# Altium schematic sheet External_Connectors.SchDoc
size A; SheetNumber: 7; SheetTotal: 8
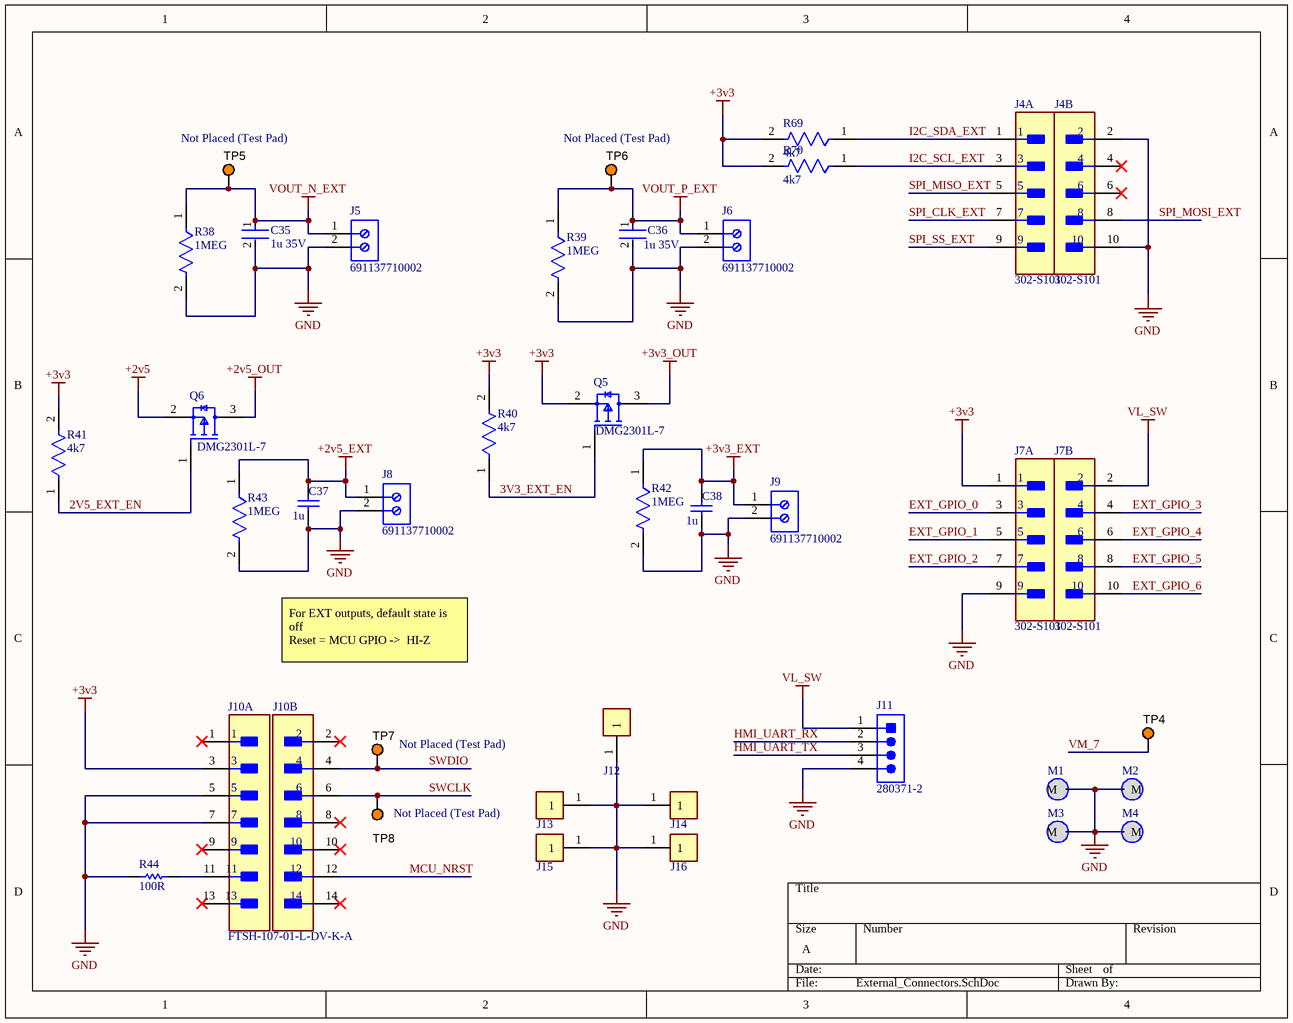
[diagram p0: External_Connectors.SchDoc]

## Parts
C35  1u 35V  [FP-CL10-IPC_C]
C36  1u 35V  [FP-CL10-IPC_C]
C37  1u  [CAPC2013X145X50NL20T25]
C38  1u  [CAPC2013X145X50NL20T25]
J4  302-S101  [FP-302-S101-MFG]  (parts A,B of 2)
J5  691137710002  [691137710002]
J6  691137710002  [691137710002]
J7  302-S101  [FP-302-S101-MFG]  (parts A,B of 2)
J8  691137710002  [691137710002]
J9  691137710002  [691137710002]
J10  FTSH-107-01-L-DV-K-A  [FP-FTSH-107-01-L-DV-K-A-MFG]  (parts A,B of 2)
J11  280371-2  [TECO-280371-2_V]
J12  5001  [FP-5001-MFG]  (value not drawn)
J13  5001  [FP-5001-MFG]  (value not drawn)
J14  5001  [FP-5001-MFG]  (value not drawn)
J15  5001  [FP-5001-MFG]  (value not drawn)
J16  5001  [FP-5001-MFG]  (value not drawn)
M1  Mounting_Holes  [Mountiing_Hole]  (value not drawn)
M2  Mounting_Holes  [Mountiing_Hole]  (value not drawn)
M3  Mounting_Holes  [Mountiing_Hole]  (value not drawn)
M4  Mounting_Holes  [Mountiing_Hole]  (value not drawn)
Q5  DMG2301L-7  [FP-SOT23-MFG]
Q6  DMG2301L-7  [FP-SOT23-MFG]
R38  1MEG  [FP-AC0603-IPC_A]
R39  1MEG  [FP-AC0603-IPC_A]
R40  4k7  [FP-AC0603-IPC_A]
R41  4k7  [FP-AC0603-IPC_A]
R42  1MEG  [FP-AC0603-IPC_A]
R43  1MEG  [FP-AC0603-IPC_A]
R44  100R  [RESC1608X55X30NL15T15]
R69  4k7  [FP-AC0603-IPC_A]
R70  4k7  [FP-AC0603-IPC_A]
TP4  5003  [KSTN-5003]  (value not drawn)
TP5  5003  [KSTN-5003]  (value not drawn)  (no BOM)
TP6  5003  [KSTN-5003]  (value not drawn)  (no BOM)
TP7  5003  [KSTN-5003]  (value not drawn)  (no BOM)
TP8  5003  [KSTN-5003]  (value not drawn)  (no BOM)

## Nets
+2v5: Q6.2(S)
+2v5_EXT: C37.2 J8.1 R43.1
+2v5_OUT: Q6.3(D)
+3v3: J7.1 J10.3 Q5.2(S) R40.2 R41.2 R69.2 R70.2
+3v3_EXT: C38.2 J9.1 R42.1
+3v3_OUT: Q5.3(D)
GND: C35.2 C36.2 C37.1 C38.1 J4.2 J4.10 J5.2 J6.2 J7.9 J8.2 J9.2 J10.5 J10.7 J11.4 J12.1 J13.1 J14.1 J15.1 J16.1 M1.M M2.M M3.M M4.M R38.2 R39.2 R42.2 R43.2 R44.2
VL_SW: J7.2 J11.1
VOUT_N_EXT: C35.1 J5.1 R38.1 TP5.1
VOUT_P_EXT: C36.1 J6.1 R39.1 TP6.1
2V5_EXT_EN: Q6.1(G) R41.1
3V3_EXT_EN: Q5.1(G) R40.1
EXT_GPIO_0: J7.3
EXT_GPIO_1: J7.5
EXT_GPIO_2: J7.7
EXT_GPIO_3: J7.4
EXT_GPIO_4: J7.6
EXT_GPIO_5: J7.8
EXT_GPIO_6: J7.10
HMI_UART_RX: J11.2
HMI_UART_TX: J11.3
I2C_SCL_EXT: J4.3 R70.1
I2C_SDA_EXT: J4.1 R69.1
MCU_NRST: J10.12
SPI_CLK_EXT: J4.7
SPI_MISO_EXT: J4.5
SPI_MOSI_EXT: J4.8
SPI_SS_EXT: J4.9
SWCLK: J10.6 TP8.1
SWDIO: J10.4 TP7.1
VM_7: TP4.1
NetJ10_11: J10.11 R44.1

Not connected (* = marked no-connect by the designer): J4 4* 6*; J10 1* 2* 8* 9* 10* 13* 14*

## Notes on the sheet
- (near TP5) Not Placed (Test Pad)
- (near TP6) Not Placed (Test Pad)
- For EXT outputs, default state is off
  Reset = MCU GPIO ->  HI-Z
- (near TP7) Not Placed (Test Pad)
- (near TP8) Not Placed (Test Pad)

## Library data of the parts
C35 C36 = CMP-13271-002885-1: Cap Ceramic 1uF 35V X5R ±10% Pad SMD 0603 +85°C T/R; Dielectric: X5R; Tolerance: 10%; Packaging: Tape and Reel; Contact Plating: Tin; Case/Package: 0603; Length: 0.063inch; Case Code (Metric): 1608; Voltage Rating (DC): 35V; Capacitance: 1uF; Package Quantity: 1; Thickness: 0.035inch; Voltage Rating: 35V; Width: 0.031inch; Min Operating Temperature: -55°C; Case Code (Imperial): 0603; Termination: Wraparound; Lead Free: Lead Free; Max Operating Temperature: 85°C; Mount: Surface Mount
C37 C38 = CMP-2007-01213-1: Part Number: C0805C106M9RACTU; Manufacturer: Kemet
J4 J7 = CMP-15228-000002-1: CONN HEADER VERT 10POS 2.54MM; Voltage Rating: 250V; Row Spacing: 0.1inch; Number of Positions: 10; Mount: Through Hole; Series: 302; Contact Type: Male Pin; Contact Plating: Gold; Contact Material: Brass; Number of Rows: 2; Color: Black; Contact Finish - Mating: GOLD; Packaging: Bulk; Pitch: 0.1inch; Fastening Type: Pull; Insulation Color: Black; Termination: Solder; Flammability Rating: UL94 V-0; Connector Type: Header; Max Operating Temperature: 105°C; Insulation Material: Glass; Contact Shape: Square; Min Operating Temperature: -40°C
J5 J6 J8 J9 = CMP-1502-03324-2: NexarPartId: 78871135; Voltage Rating: 300V; Number of Contacts: 2; Current Rating: 16A; Lead Pitch: 5mm; Height: 11.6mm; Packaging: Box; RoHS: Non-Compliant; Contact Material: Nickel, Tin; Max Operating Temperature: 120°C; Number of Pins: 2; Min Operating Temperature: -30°C; Number of Rows: 1
J10 = CMP-02766-001414-1: CONN HEADER SMD 14POS 1.27MM; Number of Contacts: 14; Gender: Male; Contact Plating: Gold; Termination: Solder; Lead Free: Lead Free; Contact Material: Bronze; Pitch: 1.27mm; Number of Rows: 2; RoHS Compliant: Yes
J11 = CMP-2000-05548-1: Male Header, Pitch 2.54 mm, 1 x 4 Position, Height 12.8 mm, Tail Length 3.5 mm, -55 to 105 degC, RoHS, Bulk; Manufacturer: TE Connectivity; Pitch: 0.100"(2.54mm); Connector Type: Header,Shrouded; Other Names: 280371-2-ND / A106401; Number of Positions Loaded: All; Dynamic Catalog: AMPMODUModIISeries; Number of Positions: 4; 3D Model: 280371-2.pdf; Termination: Solder; Package Description: Male Header, Pitch 2.54 mm, 1 x 4 Position, Height 12.8 mm, Tail Length 3.5 mm; Datasheet Version: Rev. M1, 08/2016; Contact Mating Length: 0.260"(6.60mm); Datasheet URL: http://www.te.com/commerce/DocumentDelivery/DDEController?Action=showdoc&DocId=Customer+Drawing%7F280370%7FM1%7Fpdf%7FEnglish%7FENG_CD_280370_M1.pdf%7F280371-2; Mounting Technology: ThroughHole; Standard Package: 1,000; Contact Finish Thickness: 15µin(0.38µm); Contact Finish: Gold; Contact Type: MalePin; Packaging: Bulk; Mounting Type: ThroughHole; Number of Rows: 1; Family: RectangularConnectors-Headers,MalePins; Manufacturer URL: http://www.te.com/; Color: Black; RoHS Information: 280371-2StatementofCompliance; Package Reference: 280371-2; Category: Connectors,Interconnects; Series: AMPMODUModII
J12-J16 = CMP-2000-05181-2: PC TEST POINT MINIATURE BLACK; Body Material: Bronze; Plating: Silver; Inside Diameter: 1.27mm; Hole Diameter: 1.6mm; Number of Ports: 1; Outside Diameter: 2.54mm; Insulation: Insulated; Insulation Material: Nylon; Mount: Through Hole; RoHS Compliant: Yes; Series: THM; Height: 0.3inch; Termination: Through Hole; Material: Nylon; Packaging: Bulk; Contact Material: Bronze; REACH SVHC: No SVHC; Contact Plating: Silver; Orientation: Straight; Lead Free: Lead Free; Package Quantity: 100; Length: 7.62mm; Flammability Rating: UL94 V-0; Number of Contacts: 1; Diameter: 2.54mm; Housing Color: Black; Color: Black
Q5 Q6 = CMP-12801-000065-1: MOSFET P-CH 20V 3A SOT23; Manufacturer: Diodes Inc.; Number Of Channels: 1; Turn On Delay Time: 5ns; Drain To Source Resistance: 120mΩ; Max Junction Temp: +150°C; Gate To Source Voltage: 8V; Power Dissipation: 1.5W; Rthja Max: 83°C/W; Max Forward Diode Voltage: -1.2V; Standoff Height: 0.013mm; Threshold Vgs Min: -0.4V; Input Capacitace At Vds: 476pF @ -10V; Depletion Mode: False; Gate Charge At Vgs: 5.5nC @ -4.5V; Pulse Drain Current: -10A; Drain To Source Voltage: -20V; Continuous Drain Current: -3A; Turn Off Delay Time: 30ns; Lead Free: Yes; Package: SOT23; ComponentLink2Description: Datasheet; Device Class L3: MOSFETs; Device Class L1: Discrete Semiconductors; Manufacturer Part Number: DMG2301L-7; Automotive: No; Height: 1.1mm; Category: Trans; Temperature Range High: +150°C; Digikey Description: MOSFET P-CH 20V 3A SOT23; RoHS: TRUE; Number Of P Channels: 1; Footprint Url: https://www.diodes.com/assets/Package-Files/SOT23.pdf; Octopart: https://octopart.com/dmg2301l-7-diodes+inc.-67250456; ComponentLink2URL: https://www.diodes.com/assets/Datasheets/DMG2301L.pdf; Mouser Description: Single P-Channel 20 V 1.5 W 5.5 nC Silicon Surface Mount Mosfet - SOT-23; Drain To Source Breakdown Voltage: -20V; Threshold Vgs Max: -1.2V; Device Class L2: Transistors; Temperature: -55°C to +150°C; Temperature Range Low: -55°C
R38 R39 R42 R43 = CMP-03412-042588-1: RES 1MΩ 1.00% 0.1W 0603; Tolerance: 1%; Resistance: 1MR; RoHS Compliant: Yes; Case/Package: 0603
R40 R41 R69 R70 = CMP-03412-006483-2: RES 4.7KΩ 1.00% 0.1W 0603; Tolerance: 1%; Resistance: 4.7kR; Case/Package: 0603; RoHS Compliant: Yes
R44 = CMP-2000-00258-1: Part Number: ERJ-3EKF1502V; Manufacturer: Panasonic
TP4-TP8 = CMP-1672-00009-1: Test Point, Orange, 1-Pin THD, RoHS; Peak Reverse Current: 600 uA; Forward Current: 3 A; Max Surge Current: 80 A; Forward Voltage: 1.08 V; Max Operating Temperature: 150 degC; PackageReference: 5003; Pins: 2; ComponentLink2URL: http://keyelco.com/userAssets/file/M65p56.pdf; PackageDescription: 1-Pin Through Hole Device, Dia 2.54 mm; Weight: 0.01 lb; Diameter: 5.3 mm; Mount: Through Hole; Package Quantity: 500; Packaging: Bulk; Min Operating Temperature: -65 degC; ComponentLink1Description: Manufacturer URL; Height: 0.25 inch; ComponentLink1URL: http://www.keyelco.com/; ComponentLink2Description: Datasheet; Width: 0.25 inch; REACH SVHC: No SVHC; RoHSCompliant: true; Radiation Hardening: No; Length: 9.5 mm; DatasheetVersion: Jun-15